# Altium schematic sheet CAM_POWER.SchDoc
size 420 x 297 mm; SheetNumber: 6; SheetTotal: 7
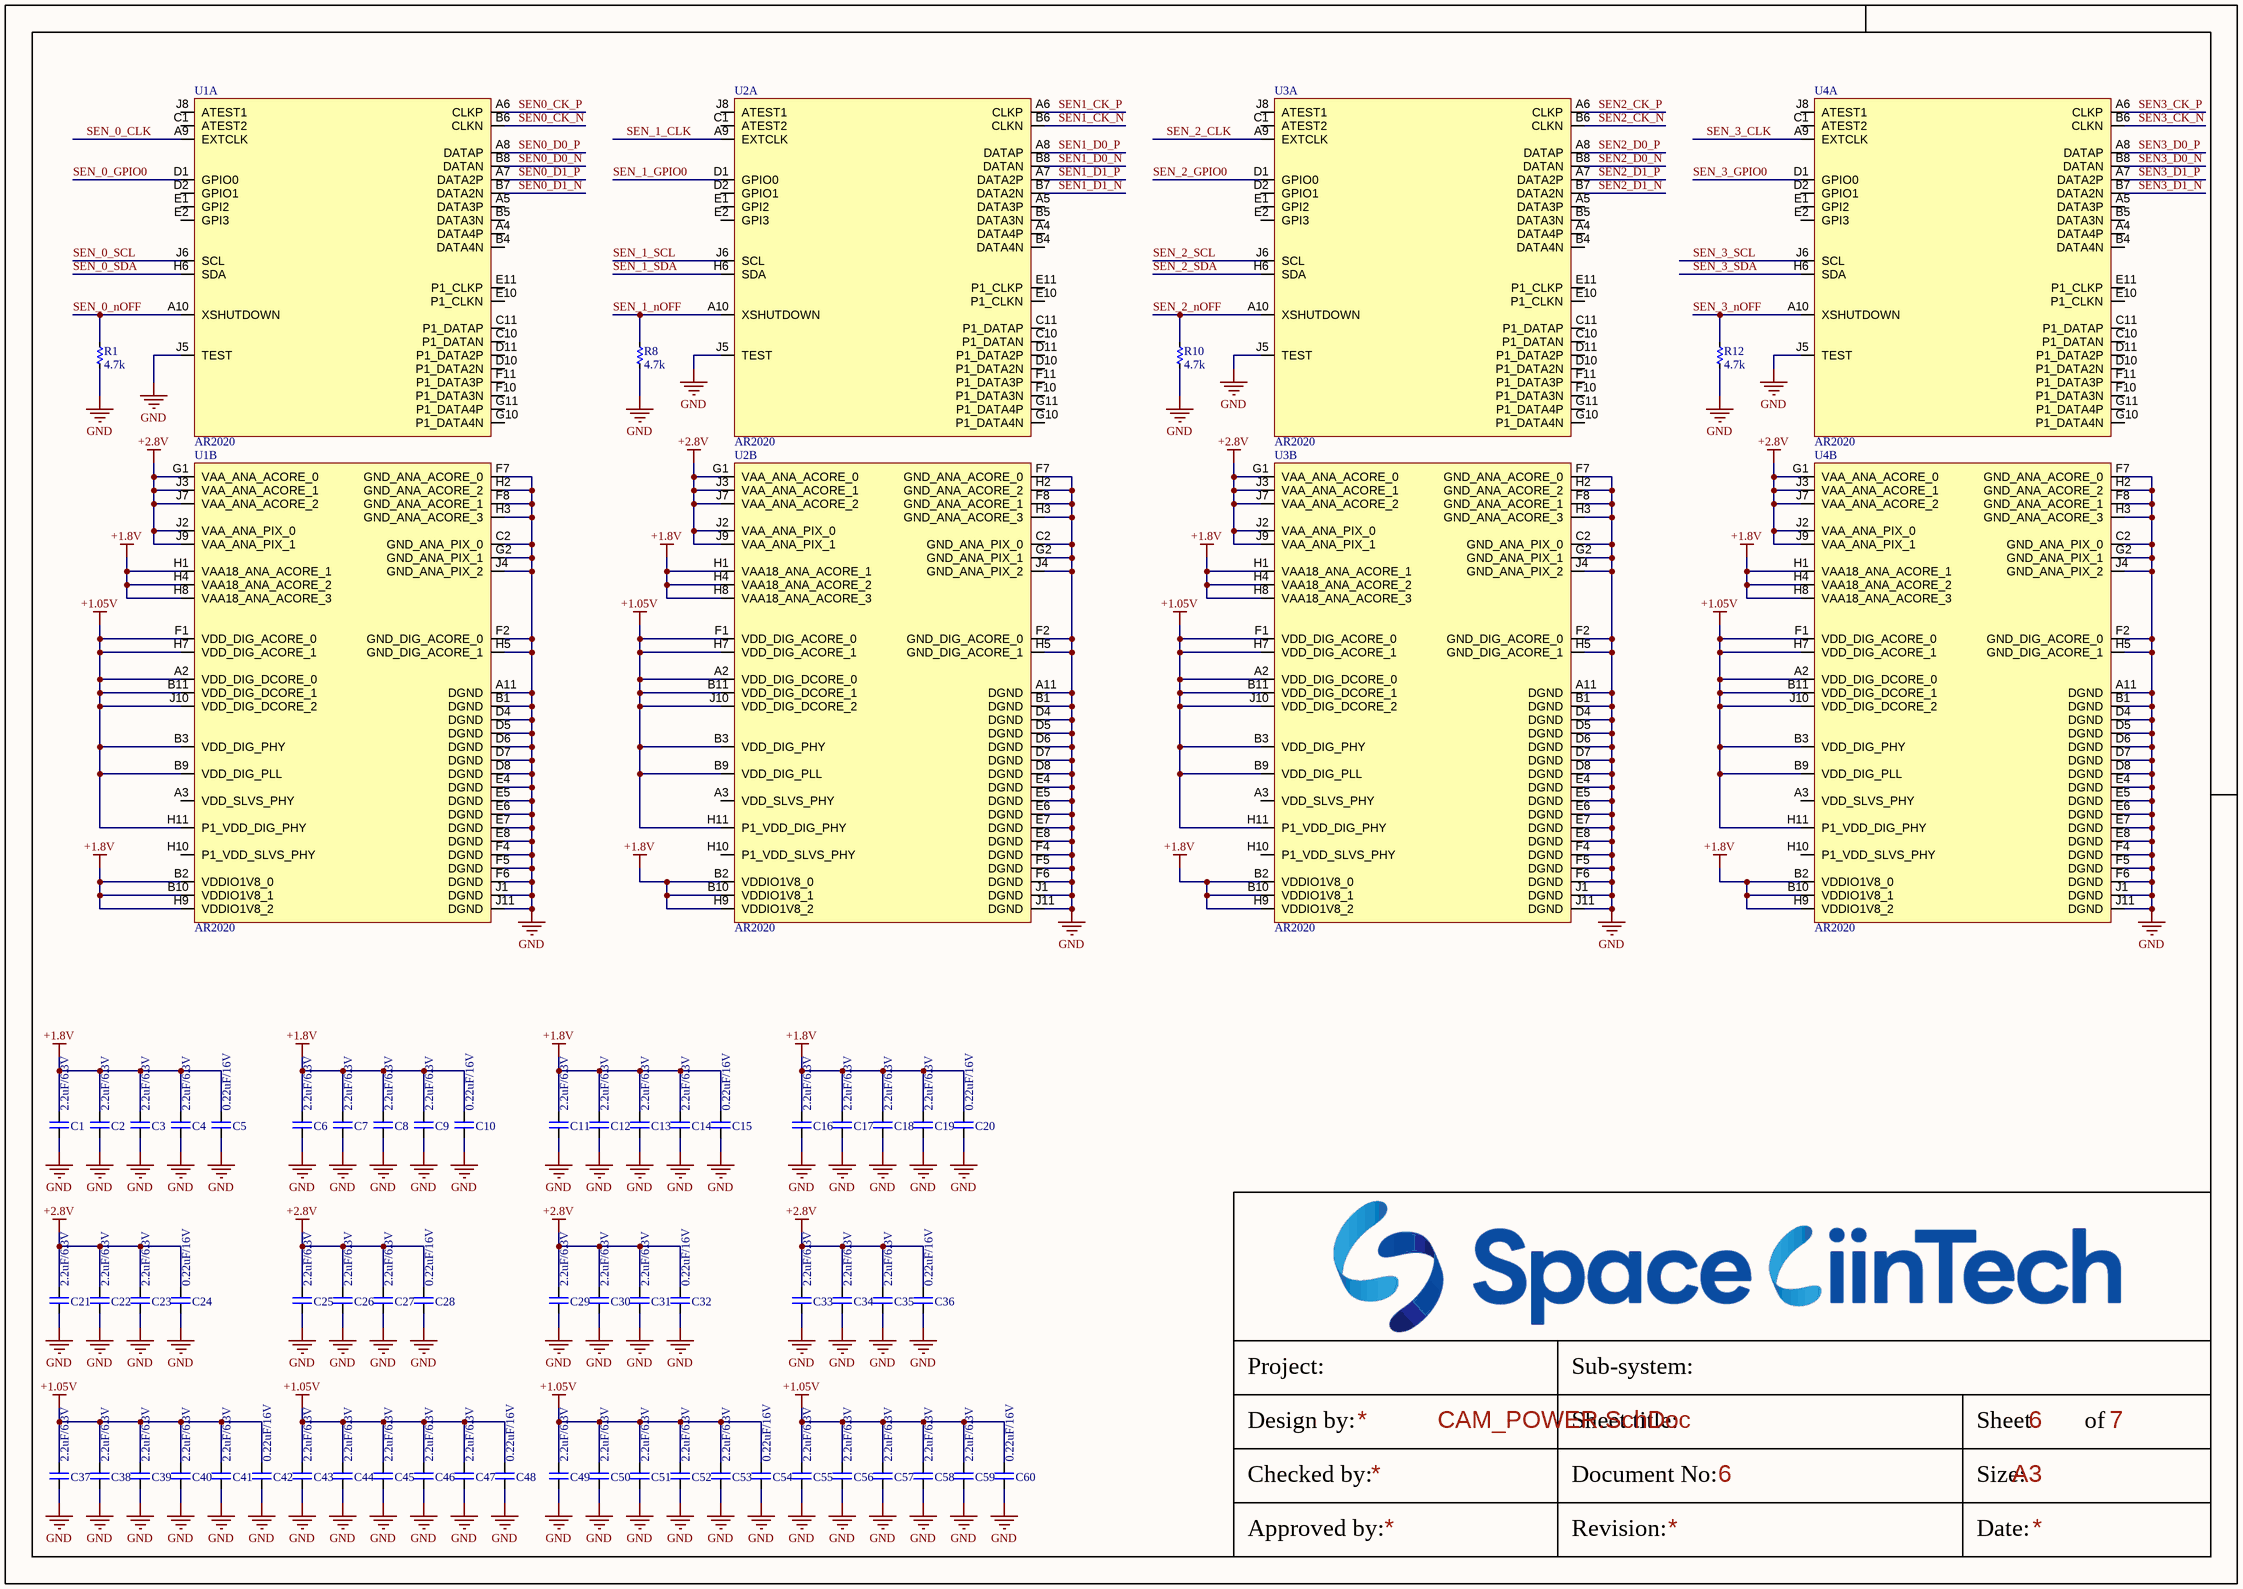
[diagram p0: CAM_POWER.SchDoc]

## Parts
C1  2.2uF/6.3V  [CAP_C_1005X60]
C2  2.2uF/6.3V  [CAP_C_1005X60]
C3  2.2uF/6.3V  [CAP_C_1005X60]
C4  2.2uF/6.3V  [CAP_C_1005X60]
C5  0.22uF/16V  [CAP_C_1005X60]
C6  2.2uF/6.3V  [CAP_C_1005X60]
C7  2.2uF/6.3V  [CAP_C_1005X60]
C8  2.2uF/6.3V  [CAP_C_1005X60]
C9  2.2uF/6.3V  [CAP_C_1005X60]
C10  0.22uF/16V  [CAP_C_1005X60]
C11  2.2uF/6.3V  [CAP_C_1005X60]
C12  2.2uF/6.3V  [CAP_C_1005X60]
C13  2.2uF/6.3V  [CAP_C_1005X60]
C14  2.2uF/6.3V  [CAP_C_1005X60]
C15  0.22uF/16V  [CAP_C_1005X60]
C16  2.2uF/6.3V  [CAP_C_1005X60]
C17  2.2uF/6.3V  [CAP_C_1005X60]
C18  2.2uF/6.3V  [CAP_C_1005X60]
C19  2.2uF/6.3V  [CAP_C_1005X60]
C20  0.22uF/16V  [CAP_C_1005X60]
C21  2.2uF/6.3V  [CAP_C_1005X60]
C22  2.2uF/6.3V  [CAP_C_1005X60]
C23  2.2uF/6.3V  [CAP_C_1005X60]
C24  0.22uF/16V  [CAP_C_1005X60]
C25  2.2uF/6.3V  [CAP_C_1005X60]
C26  2.2uF/6.3V  [CAP_C_1005X60]
C27  2.2uF/6.3V  [CAP_C_1005X60]
C28  0.22uF/16V  [CAP_C_1005X60]
C29  2.2uF/6.3V  [CAP_C_1005X60]
C30  2.2uF/6.3V  [CAP_C_1005X60]
C31  2.2uF/6.3V  [CAP_C_1005X60]
C32  0.22uF/16V  [CAP_C_1005X60]
C33  2.2uF/6.3V  [CAP_C_1005X60]
C34  2.2uF/6.3V  [CAP_C_1005X60]
C35  2.2uF/6.3V  [CAP_C_1005X60]
C36  0.22uF/16V  [CAP_C_1005X60]
C37  2.2uF/6.3V  [CAP_C_1005X60]
C38  2.2uF/6.3V  [CAP_C_1005X60]
C39  2.2uF/6.3V  [CAP_C_1005X60]
C40  2.2uF/6.3V  [CAP_C_1005X60]
C41  2.2uF/6.3V  [CAP_C_1005X60]
C42  0.22uF/16V  [CAP_C_1005X60]
C43  2.2uF/6.3V  [CAP_C_1005X60]
C44  2.2uF/6.3V  [CAP_C_1005X60]
C45  2.2uF/6.3V  [CAP_C_1005X60]
C46  2.2uF/6.3V  [CAP_C_1005X60]
C47  2.2uF/6.3V  [CAP_C_1005X60]
C48  0.22uF/16V  [CAP_C_1005X60]
C49  2.2uF/6.3V  [CAP_C_1005X60]
C50  2.2uF/6.3V  [CAP_C_1005X60]
C51  2.2uF/6.3V  [CAP_C_1005X60]
C52  2.2uF/6.3V  [CAP_C_1005X60]
C53  2.2uF/6.3V  [CAP_C_1005X60]
C54  0.22uF/16V  [CAP_C_1005X60]
C55  2.2uF/6.3V  [CAP_C_1005X60]
C56  2.2uF/6.3V  [CAP_C_1005X60]
C57  2.2uF/6.3V  [CAP_C_1005X60]
C58  2.2uF/6.3V  [CAP_C_1005X60]
C59  2.2uF/6.3V  [CAP_C_1005X60]
C60  0.22uF/16V  [CAP_C_1005X60]
R1  4.7k  [RES_C_1005X40]
R8  4.7k  [RES_C_1005X40]
R10  4.7k  [RES_C_1005X40]
R12  4.7k  [RES_C_1005X40]
U1  AR2020  [BGA78C100P11X9_1300X1050X210]  (parts A,B of 2)
U2  AR2020  [BGA78C100P11X9_1300X1050X210]  (parts A,B of 2)
U3  AR2020  [BGA78C100P11X9_1300X1050X210]  (parts A,B of 2)
U4  AR2020  [BGA78C100P11X9_1300X1050X210]  (parts A,B of 2)

## Nets
+1.05V: C37.2 C38.2 C39.2 C40.2 C41.2 C42.2 C43.2 C44.2 C45.2 C46.2 C47.2 C48.2 C49.2 C50.2 C51.2 C52.2 C53.2 C54.2 C55.2 C56.2 C57.2 C58.2 C59.2 C60.2 U1.A2(VDD_DIG_DCORE_0) U1.B3(VDD_DIG_PHY) U1.B9(VDD_DIG_PLL) U1.B11(VDD_DIG_DCORE_1) U1.F1(VDD_DIG_ACORE_0) U1.H7(VDD_DIG_ACORE_1) U1.H11(P1_VDD_DIG_PHY) U1.J10(VDD_DIG_DCORE_2) U2.A2(VDD_DIG_DCORE_0) U2.B3(VDD_DIG_PHY) U2.B9(VDD_DIG_PLL) U2.B11(VDD_DIG_DCORE_1) U2.F1(VDD_DIG_ACORE_0) U2.H7(VDD_DIG_ACORE_1) U2.H11(P1_VDD_DIG_PHY) U2.J10(VDD_DIG_DCORE_2) U3.A2(VDD_DIG_DCORE_0) U3.B3(VDD_DIG_PHY) U3.B9(VDD_DIG_PLL) U3.B11(VDD_DIG_DCORE_1) U3.F1(VDD_DIG_ACORE_0) U3.H7(VDD_DIG_ACORE_1) U3.H11(P1_VDD_DIG_PHY) U3.J10(VDD_DIG_DCORE_2) U4.A2(VDD_DIG_DCORE_0) U4.B3(VDD_DIG_PHY) U4.B9(VDD_DIG_PLL) U4.B11(VDD_DIG_DCORE_1) U4.F1(VDD_DIG_ACORE_0) U4.H7(VDD_DIG_ACORE_1) U4.H11(P1_VDD_DIG_PHY) U4.J10(VDD_DIG_DCORE_2)
+1.8V: C1.2 C2.2 C3.2 C4.2 C5.2 C6.2 C7.2 C8.2 C9.2 C10.2 C11.2 C12.2 C13.2 C14.2 C15.2 C16.2 C17.2 C18.2 C19.2 C20.2 U1.B2(VDDIO1V8_0) U1.B10(VDDIO1V8_1) U1.H1(VAA18_ANA_ACORE_1) U1.H4(VAA18_ANA_ACORE_2) U1.H8(VAA18_ANA_ACORE_3) U1.H9(VDDIO1V8_2) U2.B2(VDDIO1V8_0) U2.B10(VDDIO1V8_1) U2.H1(VAA18_ANA_ACORE_1) U2.H4(VAA18_ANA_ACORE_2) U2.H8(VAA18_ANA_ACORE_3) U2.H9(VDDIO1V8_2) U3.B2(VDDIO1V8_0) U3.B10(VDDIO1V8_1) U3.H1(VAA18_ANA_ACORE_1) U3.H4(VAA18_ANA_ACORE_2) U3.H8(VAA18_ANA_ACORE_3) U3.H9(VDDIO1V8_2) U4.B2(VDDIO1V8_0) U4.B10(VDDIO1V8_1) U4.H1(VAA18_ANA_ACORE_1) U4.H4(VAA18_ANA_ACORE_2) U4.H8(VAA18_ANA_ACORE_3) U4.H9(VDDIO1V8_2)
+2.8V: C21.2 C22.2 C23.2 C24.2 C25.2 C26.2 C27.2 C28.2 C29.2 C30.2 C31.2 C32.2 C33.2 C34.2 C35.2 C36.2 U1.G1(VAA_ANA_ACORE_0) U1.J2(VAA_ANA_PIX_0) U1.J3(VAA_ANA_ACORE_1) U1.J7(VAA_ANA_ACORE_2) U1.J9(VAA_ANA_PIX_1) U2.G1(VAA_ANA_ACORE_0) U2.J2(VAA_ANA_PIX_0) U2.J3(VAA_ANA_ACORE_1) U2.J7(VAA_ANA_ACORE_2) U2.J9(VAA_ANA_PIX_1) U3.G1(VAA_ANA_ACORE_0) U3.J2(VAA_ANA_PIX_0) U3.J3(VAA_ANA_ACORE_1) U3.J7(VAA_ANA_ACORE_2) U3.J9(VAA_ANA_PIX_1) U4.G1(VAA_ANA_ACORE_0) U4.J2(VAA_ANA_PIX_0) U4.J3(VAA_ANA_ACORE_1) U4.J7(VAA_ANA_ACORE_2) U4.J9(VAA_ANA_PIX_1)
GND: C1.1 C2.1 C3.1 C4.1 C5.1 C6.1 C7.1 C8.1 C9.1 C10.1 C11.1 C12.1 C13.1 C14.1 C15.1 C16.1 C17.1 C18.1 C19.1 C20.1 C21.1 C22.1 C23.1 C24.1 C25.1 C26.1 C27.1 C28.1 C29.1 C30.1 C31.1 C32.1 C33.1 C34.1 C35.1 C36.1 C37.1 C38.1 C39.1 C40.1 C41.1 C42.1 C43.1 C44.1 C45.1 C46.1 C47.1 C48.1 C49.1 C50.1 C51.1 C52.1 C53.1 C54.1 C55.1 C56.1 C57.1 C58.1 C59.1 C60.1 R1.2 R8.2 R10.2 R12.2 U1.A11(DGND) U1.B1(DGND) U1.C2(GND_ANA_PIX_0) U1.D4(DGND) U1.D5(DGND) U1.D6(DGND) U1.D7(DGND) U1.D8(DGND) U1.E4(DGND) U1.E5(DGND) U1.E6(DGND) U1.E7(DGND) U1.E8(DGND) U1.F2(GND_DIG_ACORE_0) U1.F4(DGND) U1.F5(DGND) U1.F6(DGND) U1.F7(GND_ANA_ACORE_0) U1.F8(GND_ANA_ACORE_1) U1.G2(GND_ANA_PIX_1) U1.H2(GND_ANA_ACORE_2) U1.H3(GND_ANA_ACORE_3) U1.H5(GND_DIG_ACORE_1) U1.J1(DGND) U1.J4(GND_ANA_PIX_2) U1.J5(TEST) U1.J11(DGND) U2.A11(DGND) U2.B1(DGND) U2.C2(GND_ANA_PIX_0) U2.D4(DGND) U2.D5(DGND) U2.D6(DGND) U2.D7(DGND) U2.D8(DGND) U2.E4(DGND) U2.E5(DGND) U2.E6(DGND) U2.E7(DGND) U2.E8(DGND) U2.F2(GND_DIG_ACORE_0) U2.F4(DGND) U2.F5(DGND) U2.F6(DGND) U2.F7(GND_ANA_ACORE_0) U2.F8(GND_ANA_ACORE_1) U2.G2(GND_ANA_PIX_1) U2.H2(GND_ANA_ACORE_2) U2.H3(GND_ANA_ACORE_3) U2.H5(GND_DIG_ACORE_1) U2.J1(DGND) U2.J4(GND_ANA_PIX_2) U2.J5(TEST) U2.J11(DGND) U3.A11(DGND) U3.B1(DGND) U3.C2(GND_ANA_PIX_0) U3.D4(DGND) U3.D5(DGND) U3.D6(DGND) U3.D7(DGND) U3.D8(DGND) U3.E4(DGND) U3.E5(DGND) U3.E6(DGND) U3.E7(DGND) U3.E8(DGND) U3.F2(GND_DIG_ACORE_0) U3.F4(DGND) U3.F5(DGND) U3.F6(DGND) U3.F7(GND_ANA_ACORE_0) U3.F8(GND_ANA_ACORE_1) U3.G2(GND_ANA_PIX_1) U3.H2(GND_ANA_ACORE_2) U3.H3(GND_ANA_ACORE_3) U3.H5(GND_DIG_ACORE_1) U3.J1(DGND) U3.J4(GND_ANA_PIX_2) U3.J5(TEST) U3.J11(DGND) U4.A11(DGND) U4.B1(DGND) U4.C2(GND_ANA_PIX_0) U4.D4(DGND) U4.D5(DGND) U4.D6(DGND) U4.D7(DGND) U4.D8(DGND) U4.E4(DGND) U4.E5(DGND) U4.E6(DGND) U4.E7(DGND) U4.E8(DGND) U4.F2(GND_DIG_ACORE_0) U4.F4(DGND) U4.F5(DGND) U4.F6(DGND) U4.F7(GND_ANA_ACORE_0) U4.F8(GND_ANA_ACORE_1) U4.G2(GND_ANA_PIX_1) U4.H2(GND_ANA_ACORE_2) U4.H3(GND_ANA_ACORE_3) U4.H5(GND_DIG_ACORE_1) U4.J1(DGND) U4.J4(GND_ANA_PIX_2) U4.J5(TEST) U4.J11(DGND)
SEN0_CK_N: U1.B6(CLKN)
SEN0_CK_P: U1.A6(CLKP)
SEN0_D0_N: U1.B8(DATAN)
SEN0_D0_P: U1.A8(DATAP)
SEN0_D1_N: U1.B7(DATA2N)
SEN0_D1_P: U1.A7(DATA2P)
SEN1_CK_N: U2.B6(CLKN)
SEN1_CK_P: U2.A6(CLKP)
SEN1_D0_N: U2.B8(DATAN)
SEN1_D0_P: U2.A8(DATAP)
SEN1_D1_N: U2.B7(DATA2N)
SEN1_D1_P: U2.A7(DATA2P)
SEN2_CK_N: U3.B6(CLKN)
SEN2_CK_P: U3.A6(CLKP)
SEN2_D0_N: U3.B8(DATAN)
SEN2_D0_P: U3.A8(DATAP)
SEN2_D1_N: U3.B7(DATA2N)
SEN2_D1_P: U3.A7(DATA2P)
SEN3_CK_N: U4.B6(CLKN)
SEN3_CK_P: U4.A6(CLKP)
SEN3_D0_N: U4.B8(DATAN)
SEN3_D0_P: U4.A8(DATAP)
SEN3_D1_N: U4.B7(DATA2N)
SEN3_D1_P: U4.A7(DATA2P)
SEN_0_CLK: U1.A9(EXTCLK)
SEN_0_GPIO0: U1.D1(GPIO0)
SEN_0_nOFF: R1.1 U1.A10(XSHUTDOWN)
SEN_0_SCL: U1.J6(SCL)
SEN_0_SDA: U1.H6(SDA)
SEN_1_CLK: U2.A9(EXTCLK)
SEN_1_GPIO0: U2.D1(GPIO0)
SEN_1_nOFF: R8.1 U2.A10(XSHUTDOWN)
SEN_1_SCL: U2.J6(SCL)
SEN_1_SDA: U2.H6(SDA)
SEN_2_CLK: U3.A9(EXTCLK)
SEN_2_GPIO0: U3.D1(GPIO0)
SEN_2_nOFF: R10.1 U3.A10(XSHUTDOWN)
SEN_2_SCL: U3.J6(SCL)
SEN_2_SDA: U3.H6(SDA)
SEN_3_CLK: U4.A9(EXTCLK)
SEN_3_GPIO0: U4.D1(GPIO0)
SEN_3_nOFF: R12.1 U4.A10(XSHUTDOWN)
SEN_3_SCL: U4.J6(SCL)
SEN_3_SDA: U4.H6(SDA)

Not connected (* = marked no-connect by the designer): U1 A3(VDD_SLVS_PHY) A4(DATA4P) A5(DATA3P) B4(DATA4N) B5(DATA3N) C1(ATEST2) C10(P1_DATAN) C11(P1_DATAP) D2(GPIO1) D10(P1_DATA2N) D11(P1_DATA2P) E1(GPI2) E2(GPI3) E10(P1_CLKN) E11(P1_CLKP) F10(P1_DATA3N) F11(P1_DATA3P) G10(P1_DATA4N) G11(P1_DATA4P) H10(P1_VDD_SLVS_PHY) J8(ATEST1); U2 A3(VDD_SLVS_PHY) A4(DATA4P) A5(DATA3P) B4(DATA4N) B5(DATA3N) C1(ATEST2) C10(P1_DATAN) C11(P1_DATAP) D2(GPIO1) D10(P1_DATA2N) D11(P1_DATA2P) E1(GPI2) E2(GPI3) E10(P1_CLKN) E11(P1_CLKP) F10(P1_DATA3N) F11(P1_DATA3P) G10(P1_DATA4N) G11(P1_DATA4P) H10(P1_VDD_SLVS_PHY) J8(ATEST1); U3 A3(VDD_SLVS_PHY) A4(DATA4P) A5(DATA3P) B4(DATA4N) B5(DATA3N) C1(ATEST2) C10(P1_DATAN) C11(P1_DATAP) D2(GPIO1) D10(P1_DATA2N) D11(P1_DATA2P) E1(GPI2) E2(GPI3) E10(P1_CLKN) E11(P1_CLKP) F10(P1_DATA3N) F11(P1_DATA3P) G10(P1_DATA4N) G11(P1_DATA4P) H10(P1_VDD_SLVS_PHY) J8(ATEST1); U4 A3(VDD_SLVS_PHY) A4(DATA4P) A5(DATA3P) B4(DATA4N) B5(DATA3N) C1(ATEST2) C10(P1_DATAN) C11(P1_DATAP) D2(GPIO1) D10(P1_DATA2N) D11(P1_DATA2P) E1(GPI2) E2(GPI3) E10(P1_CLKN) E11(P1_CLKP) F10(P1_DATA3N) F11(P1_DATA3P) G10(P1_DATA4N) G11(P1_DATA4P) H10(P1_VDD_SLVS_PHY) J8(ATEST1)

## Notes on the sheet
- Project:
- Sub-system:
- Design by:
- Sheet title:
- Sheet
- of
- Checked by:
- Approved by:
- Revision:
- Document No:
- Size:
- Date:
- A3

## Library data of the parts
C1-C60 = CAP_SMD: CAP_Chip; Value: 33pF
R1 R8 R10 R12 = RES-SMD: RES-Chip; Manufacturer: Generic Components; Class: Passive; Published: 08/06/2000; Publisher: Altium Hobart Technology Centre